# Altium schematic sheet JTAG.SchDoc: JTAG
size Letter; Engineer: Nathan Petersen; DocumentNumber: 22; Revision: v1.2; SheetNumber: 22; SheetTotal: 25
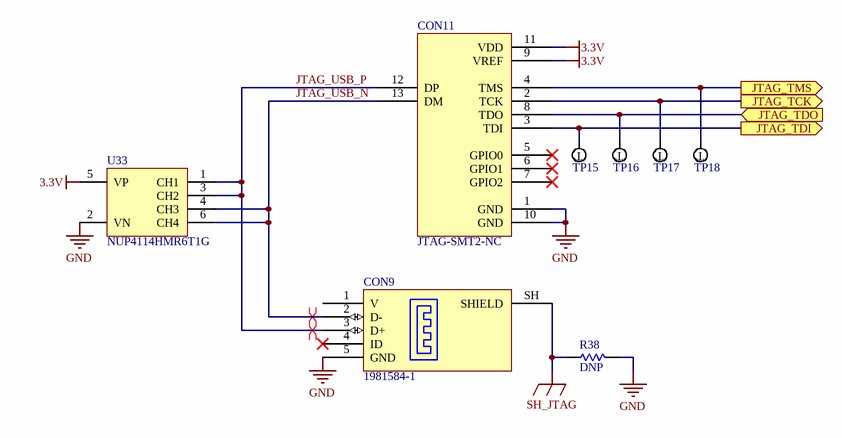
[diagram p0: JTAG.SchDoc]

## Parts
CON9  1981584-1  [1981584-1]
CON11  JTAG-SMT2-NC  [JTAG-SMT2-NC]
R38  value DNP  [0603-RES]  (hidden comment: Resistor)
TP15  Test Point  [TP-125]  (value not drawn)  (no BOM)
TP16  Test Point  [TP-125]  (value not drawn)  (no BOM)
TP17  Test Point  [TP-125]  (value not drawn)  (no BOM)
TP18  Test Point  [TP-125]  (value not drawn)  (no BOM)
U33  NUP4114HMR6T1G  [TSOP95P280X110-6N]

## Ports
JTAG_TCK (out), JTAG_TDI (out), JTAG_TDO (in), JTAG_TMS (out)

## Nets
3.3V: CON11.9(VREF) CON11.11(VDD) U33.5(VP)
GND: CON9.5(GND) CON11.1(GND) CON11.10(GND) R38.2 U33.2(VN)
SH_JTAG: CON9.SH(SHIELD) R38.1
JTAG_TCK: CON11.2(TCK) TP17.1 ; port JTAG_TCK
JTAG_TDI: CON11.3(TDI) TP15.1 ; port JTAG_TDI
JTAG_TDO: CON11.8(TDO) TP16.1 ; port JTAG_TDO
JTAG_TMS: CON11.4(TMS) TP18.1 ; port JTAG_TMS
JTAG_USB_N: CON9.2(D-) CON11.13(DM) U33.4(CH3) U33.6(CH4)
JTAG_USB_P: CON9.3(D+) CON11.12(DP) U33.1(CH1) U33.3(CH2)

Not connected (* = marked no-connect by the designer): CON9 1(V) 4(ID)*; CON11 5(GPIO0)* 6(GPIO1)* 7(GPIO2)*

## Layout directives
differential pair: JTAG_USB_N, JTAG_USB_P

## Notes on the sheet
- Title:
- File:
- Sheet:
- of
- Revision:
- Time:
- Date:
- Engineer:
- (in symbol Test Point) T

## Library data of the parts
CON9 = 1981584-1: CONN RCPT MICRO USB TYPE AB; Supplier 1: Digi-Key; Supplier Part Number 1: A97799TR-ND
CON11 = JTAG-SMT2-NC: MOD PROGRAMMING JTAG-SMT2-NC; Supplier 1: Digi-Key; Supplier Part Number 1: 1286-1192-ND
U33 = NUP4114HMR6T1G: TVS DIODE 5.5V 10V 6TSOP; Supplier 1: Digi-Key; Supplier Part Number 1: NUP4114HMR6T1GOSCT-ND
R38 = Resistor: Supplier 1: Digi-Key; Supplier Part Number 1: P0.0GDKR-ND